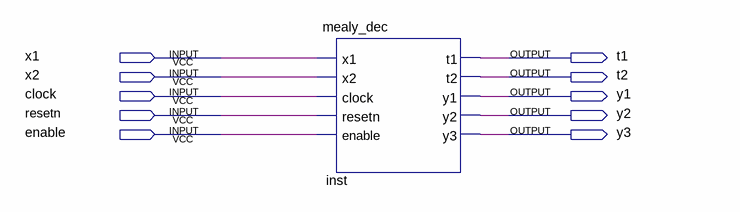
[diagram p0: schematic sheet]
// Quartus schematic mealy_full_decompose.bdf as structural Verilog: 1 symbols, 10 pins
module mealy_full_decompose (
  input  x1,
  input  x2,
  input  clock,
  input  resetn,
  input  enable,
  output t1,
  output t2,
  output y1,
  output y2,
  output y3
);

  mealy_dec inst (
    .x1(x1), .x2(x2), .clock(clock), .resetn(resetn), .enable(enable), .t1(t1), .t2(t2), .y1(y1), .y2(y2),
    .y3(y3));
endmodule
